# Altium schematic sheet Servo.SchDoc
size A
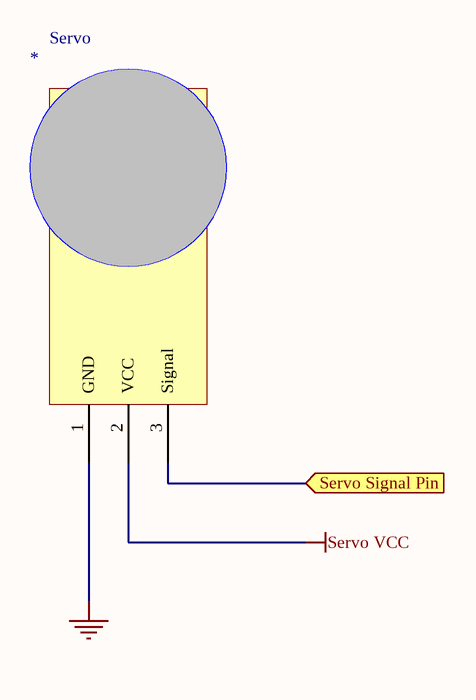
[diagram p0: Servo.SchDoc]

## Parts
*  Servo

## Ports
Servo Signal Pin (in)

## Nets
GND: *.1(GND)
Servo VCC: *.2(VCC)
Servo Signal Pin: *.3(Signal) ; port Servo Signal Pin